# Altium schematic sheet Isolator.SchDoc
size A
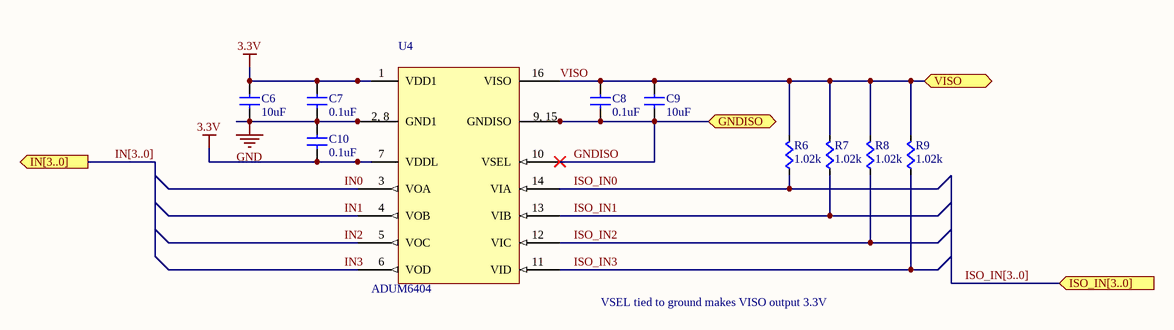
[diagram p0: Isolator.SchDoc]

## Parts
C6  value 10uF  [CAPC0603]  (hidden comment: Cap)
C7  value 0.1uF  [CAPC0603]  (hidden comment: Cap)
C8  value 0.1uF  [CAPC0603]  (hidden comment: Cap)
C9  value 10uF  [CAPC0603]  (hidden comment: Cap)
C10  value 0.1uF  [CAPC0603]  (hidden comment: Cap)
R6  value 1.02k  [RES0603]  (hidden comment: Res)
R7  value 1.02k  [RES0603]  (hidden comment: Res)
R8  value 1.02k  [RES0603]  (hidden comment: Res)
R9  value 1.02k  [RES0603]  (hidden comment: Res)
U4  ADUM6404  [SOIC127P1030X265-16N]

## Ports
GNDISO, IN[3..0] (out), ISO_IN[3..0] (in), VISO

## Nets
3.3V: C6.2(B) C7.2(B) C10.1(A) U4.1(VDD1) U4.7(VDDL)
GND: C6.1(A) C7.1(A) C10.2(B) U4.2(GND1) U4.8(GND1)
GNDISO: C8.1(A) C9.1(A) U4.9(GNDISO) U4.10(VSEL) U4.15(GNDISO) ; port GNDISO
IN0: U4.3(VOA)
IN1: U4.4(VOB)
IN2: U4.5(VOC)
IN3: U4.6(VOD)
ISO_IN0: R6.2(B) U4.14(VIA)
ISO_IN1: R7.2(B) U4.13(VIB)
ISO_IN2: R8.2(B) U4.12(VIC)
ISO_IN3: R9.2(B) U4.11(VID)
VISO: C8.2(B) C9.2(B) R6.1(A) R7.1(A) R8.1(A) R9.1(A) U4.16(VISO) ; port VISO

## Buses and harness runs
bus IN[3..0] = port IN[3..0]
bus ISO_IN[3..0] = port ISO_IN[3..0]

## Notes on the sheet
- VSEL tied to ground makes VISO output 3.3V
- (in symbol ADUM6404) 2, 8; 9, 15

## Library data of the parts
U4 = ADUM6404: Digital Isolator, 4 channel, with isolated power; Supplier 1: Digi-Key; Supplier Part Number 1: ADUM6404ARWZ-ND
C6-C10 = Cap: Supplier 1: Digi-Key
  C6 C9: Supplier Part Number 1: 445-4112-1-ND
  C7 C8 C10: Supplier Part Number 1: 445-1314-1-ND
R6-R9 = Res: Supplier 1: Digi-Key; Supplier Part Number 1: 311-1.02KHRCT-ND